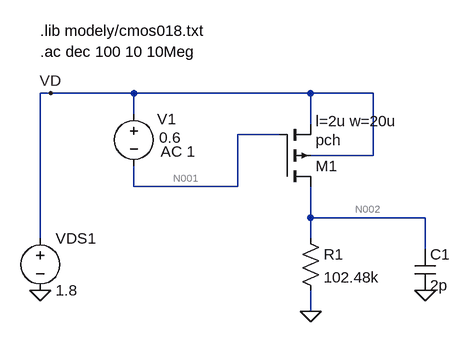
[diagram p0: schematic ses-odpor-zatez.asc]
ses-odpor-zatez.asc, the LTspice schematic file:
Version 4
SHEET 1 880 680
WIRE -80 -16 -96 -16
WIRE 48 -16 -80 -16
WIRE 320 -16 48 -16
WIRE 416 -16 320 -16
WIRE 48 16 48 -16
WIRE 320 32 320 -16
WIRE 272 48 208 48
WIRE 416 80 416 -16
WIRE 416 80 320 80
WIRE 48 128 48 96
WIRE 208 128 208 48
WIRE 208 128 48 128
WIRE 320 176 320 128
WIRE 496 176 320 176
WIRE -96 208 -96 -16
WIRE 320 208 320 176
WIRE 496 224 496 176
WIRE 320 320 320 288
FLAG 320 320 0
FLAG -96 288 0
FLAG -80 -16 VD
FLAG 496 288 0
SYMBOL voltage -96 192 R0
WINDOW 123 0 0 Left 0
WINDOW 39 0 0 Left 0
SYMATTR InstName VDS1
SYMATTR Value 1.8
SYMBOL pmos4 272 128 M180
WINDOW 123 56 101 Left 2
SYMATTR Value2 l=2u w=20u
SYMATTR InstName M1
SYMATTR Value pch
SYMBOL res 304 192 R0
SYMATTR InstName R1
SYMATTR Value 102.48k
SYMBOL voltage 48 0 R0
WINDOW 0 36 24 Left 2
WINDOW 3 39 52 Left 2
WINDOW 123 41 74 Left 2
WINDOW 39 0 0 Left 0
SYMATTR InstName V1
SYMATTR Value 0.6
SYMATTR Value2 AC 1
SYMBOL cap 480 224 R0
SYMATTR InstName C1
SYMATTR Value 2p
TEXT -96 -112 Left 2 !.lib modely/cmos018.txt
TEXT -96 -80 Left 2 !.ac dec 100 10 10Meg

The netlist it stands for:
* ses-odpor-zatez.asc
VDS1 VD 0 1.8
M1 N002 N001 VD VD pch l=2u w=20u
R1 N002 0 102.48k
V1 VD N001 0.6 AC 1
C1 N002 0 2p
.model NMOS NMOS
.model PMOS PMOS
.lib standard.mos
.lib modely/cmos018.txt
.ac dec 100 10 10Meg
.backanno
.end

* Results of the author's LTspice run, read from the files saved beside the schematic
* Operating Point, zero values left out:
*   V(vd) = 1.8 V
*   V(n002) = 1.141 V
*   V(n001) = 1.2 V
*   Id(M1) = -11.13 µA
*   Is(M1) = 11.13 µA
*   I(R1) = 11.13 µA
*   I(Vds1) = -11.13 µA
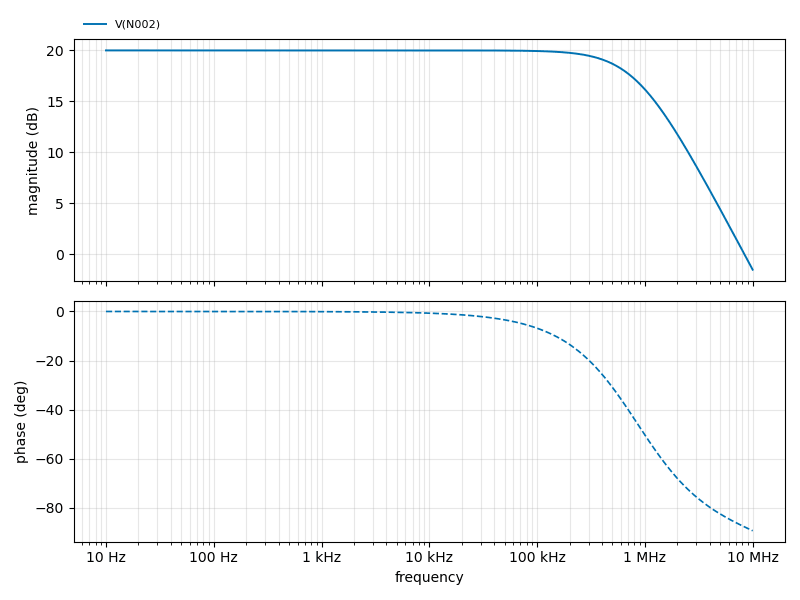
[diagram p1: AC Analysis of ses-odpor-zatez.asc, plotted from the saved traces]
* AC Analysis, 1 run:
*   V(N002): 20.00 dB at 10 Hz, -1.50 dB at 10 MHz, peak 20.00 dB at 10 Hz, 3 dB below the peak at 841.7 kHz